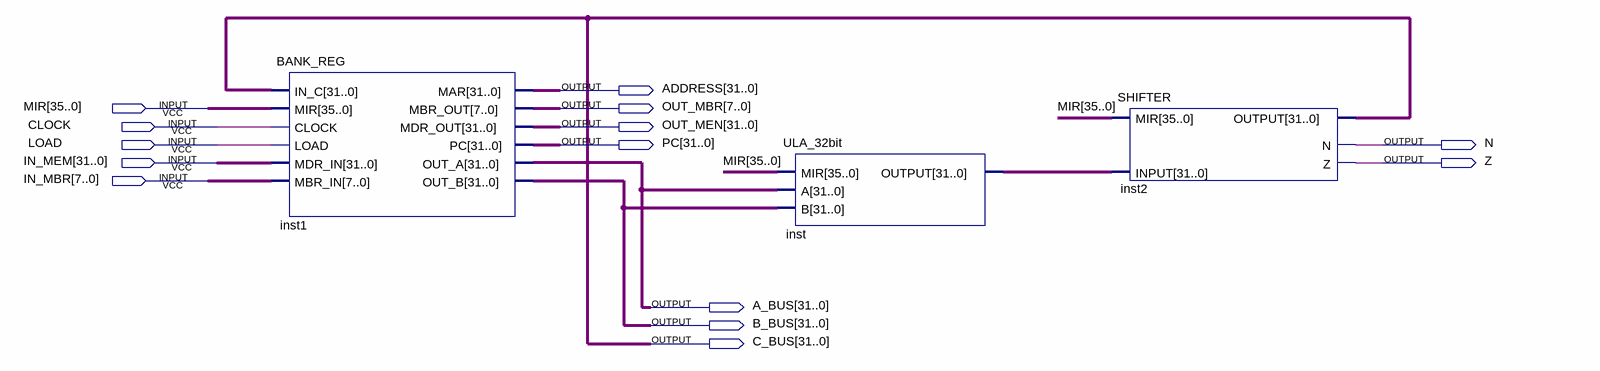
[diagram p0: schematic sheet]
// Quartus schematic data_path.bdf as structural Verilog: 3 symbols, 14 pins
module data_path (
  input  [35:0] MIR,
  input  CLOCK,
  input  LOAD,
  input  [31:0] IN_MEM,
  input  [7:0] IN_MBR,
  output [31:0] ADDRESS,
  output [7:0] OUT_MBR,
  output [31:0] OUT_MEN,
  output [31:0] PC,
  output N,
  output Z,
  output [31:0] A_BUS,
  output [31:0] B_BUS,
  output [31:0] C_BUS
);

  wire [31:0] inst_output;

  BANK_REG inst1 (
    .IN_C(C_BUS), .MIR(MIR), .CLOCK(CLOCK), .LOAD(LOAD), .MDR_IN(IN_MEM), .MBR_IN(IN_MBR), .MAR(ADDRESS),
    .OUT_B(B_BUS), .MDR_OUT(OUT_MEN), .PC(PC), .MBR_OUT(OUT_MBR), .OUT_A(A_BUS));
  ULA_32bit inst (.MIR(MIR), .A(A_BUS), .B(B_BUS), .OUTPUT(inst_output));
  SHIFTER inst2 (.INPUT(inst_output), .MIR(MIR), .OUTPUT(C_BUS), .N(N), .Z(Z));
endmodule
